# Altium schematic sheet LEDs.SchDoc
size A4
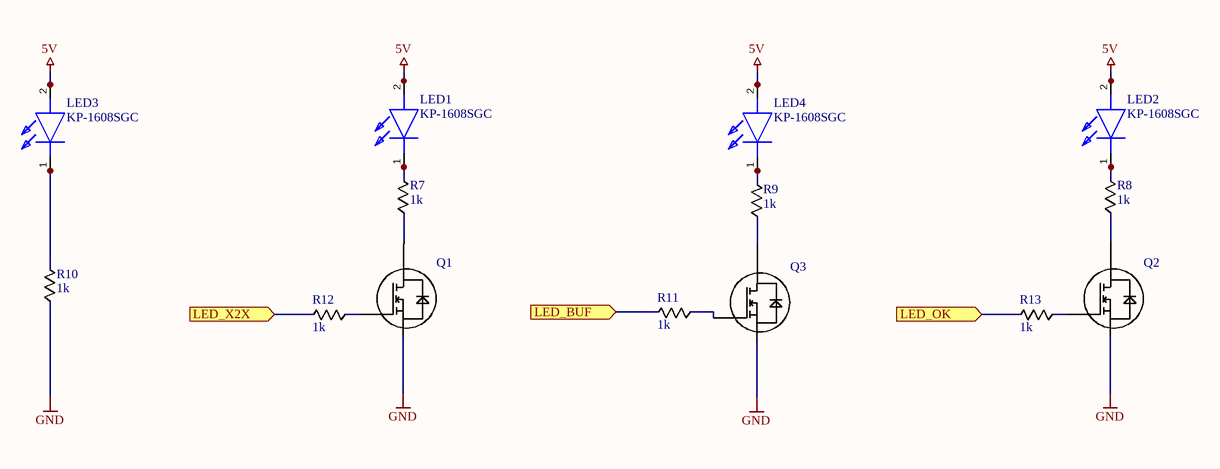
[diagram p0: LEDs.SchDoc]

## Parts
LED1  KP-1608SGC  [KP-1608SGC]
LED2  KP-1608SGC  [KP-1608SGC]
LED3  KP-1608SGC  [KP-1608SGC]
LED4  KP-1608SGC  [KP-1608SGC]
Q1  MOSFET-N  [SOT-23]  (value not drawn)
Q2  MOSFET-N  [SOT-23]  (value not drawn)
Q3  MOSFET-N  [SOT-23]  (value not drawn)
R7  1k  [0603 CAP]
R8  1k  [0603 CAP]
R9  1k  [0603 CAP]
R10  1k  [0603 CAP]
R11  1k  [0603 CAP]
R12  1k  [0603 CAP]
R13  1k  [0603 CAP]

## Ports
LED_BUF, LED_OK, LED_X2X

## Nets
5V: LED1.2(A) LED2.2(A) LED3.2(A) LED4.2(A)
GND: Q1.2(S) Q2.2(S) Q3.2(S) R10.1
LED_BUF: R11.2 ; port LED_BUF
LED_OK: R13.2 ; port LED_OK
LED_X2X: R12.2 ; port LED_X2X
NetLED1_1: LED1.1(K) R7.2
NetLED2_1: LED2.1(K) R8.2
NetLED3_1: LED3.1(K) R10.2
NetLED4_1: LED4.1(K) R9.2
NetQ1_1: Q1.1(G) R12.1
NetQ1_3: Q1.3(D) R7.1
NetQ2_1: Q2.1(G) R13.1
NetQ2_3: Q2.3(D) R8.1
NetQ3_1: Q3.1(G) R11.1
NetQ3_3: Q3.3(D) R9.1

## Library data of the parts
LED1-LED4 = KP-1608SGC: Manufacturer_Name: Kingbright; Datasheet Link: KP-1608SGC; Height: 1.2mm; Manufacturer_Part_Number: KP-1608SGC; Mouser Part Number: N/A; Mouser Price/Stock: https://www.mouser.co.uk/ProductDetail/Kingbright/KP-1608SGC?qs=2JU0tDl2GZ13Q%2F1QAsmViw%3D%3D; Arrow Part Number: KP-1608SGC; Arrow Price/Stock: https://www.arrow.com/en/products/kp-1608sgc/kingbright?utm_currency=USD&region=nac
Q1-Q3 = BSS138: IRLML2502TR
R7-R13 = 0603 RES